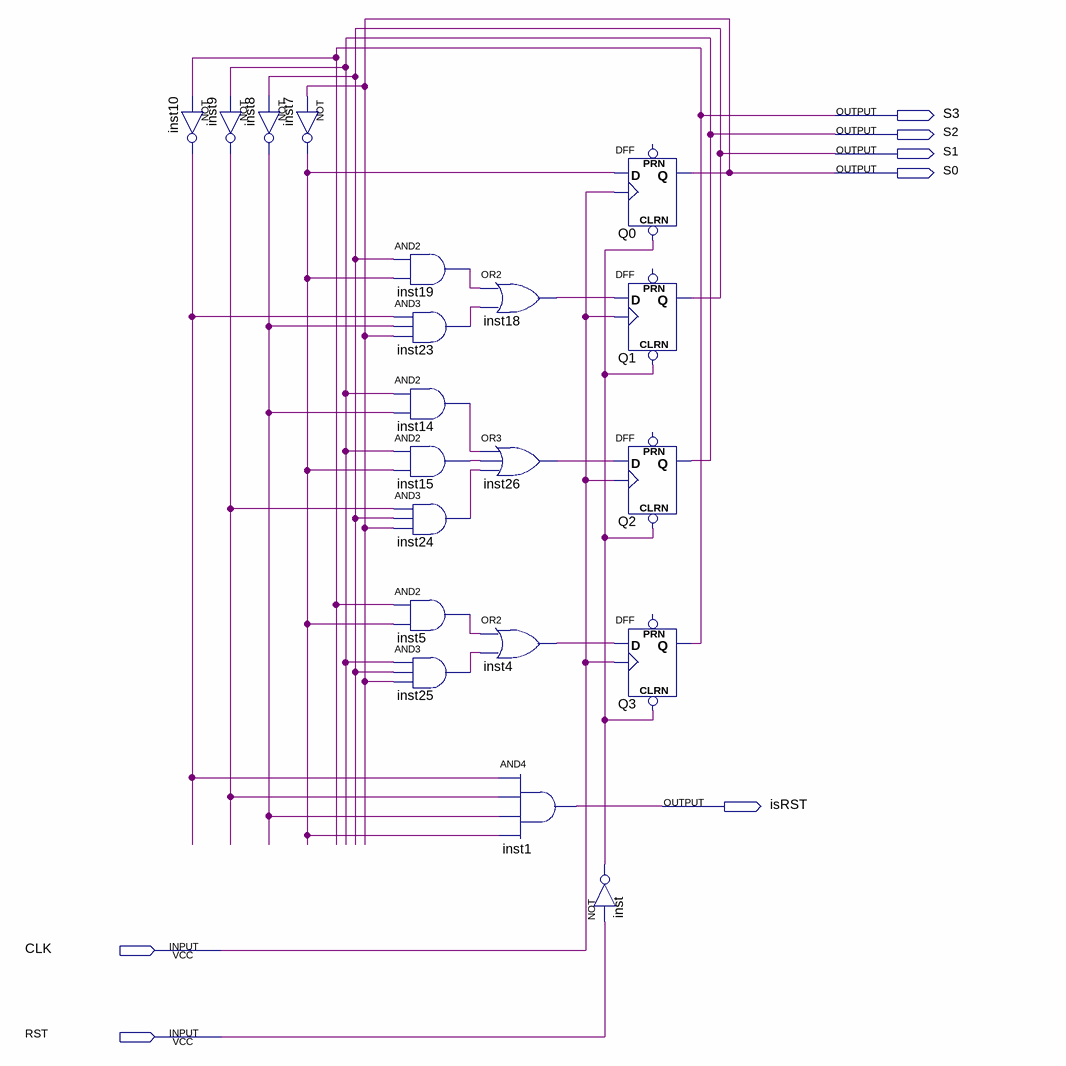
[diagram p0: schematic sheet]
// Quartus schematic BCD-COUNTER.bdf as structural Verilog: 20 symbols, 7 pins
module \BCD-COUNTER  (
  input  CLK,
  input  RST,
  output S3,
  output S2,
  output S1,
  output S0,
  output isRST
);

  wire inst4_out, inst5_out, inst7_out, inst8_out, inst9_out, inst10_out, inst14_out, inst15_out, inst18_out,
       inst19_out, inst23_out, inst24_out, inst25_out, inst26_out, inst_out;

  not inst9 (inst9_out, S2);
  not inst10 (inst10_out, S3);
  not inst7 (inst7_out, S0);
  not inst8 (inst8_out, S1);
  and inst19 (inst19_out, S1, inst7_out);
  and inst23 (inst23_out, inst10_out, inst8_out, S0);
  and inst14 (inst14_out, S2, inst8_out);
  and inst15 (inst15_out, S2, inst7_out);
  and inst24 (inst24_out, inst9_out, S1, S0);
  and inst5 (inst5_out, S3, inst7_out);
  and inst25 (inst25_out, S2, S1, S0);
  or inst18 (inst18_out, inst19_out, inst23_out);
  or inst26 (inst26_out, inst14_out, inst15_out, inst24_out);
  or inst4 (inst4_out, inst5_out, inst25_out);
  and inst1 (isRST, inst10_out, inst9_out, inst8_out, inst7_out);
  DFF Q0 (.CLRN(inst_out), .CLK(CLK), .D(inst7_out), .Q(S0));  // open: PRN
  DFF Q1 (.CLRN(inst_out), .CLK(CLK), .D(inst18_out), .Q(S1));  // open: PRN
  DFF Q2 (.CLRN(inst_out), .CLK(CLK), .D(inst26_out), .Q(S2));  // open: PRN
  DFF Q3 (.CLRN(inst_out), .CLK(CLK), .D(inst4_out), .Q(S3));  // open: PRN
  not inst (inst_out, RST);
endmodule
